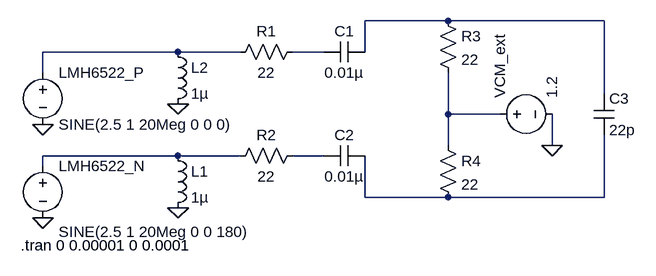
[diagram p0: schematic VCM switch.asc]
VCM switch.asc, the LTspice schematic file:
Version 4
SHEET 1 904 680
WIRE 608 -16 480 -16
WIRE 848 -16 608 -16
WIRE 192 32 -16 32
WIRE 288 32 192 32
WIRE 416 32 368 32
WIRE 480 32 480 -16
WIRE -16 64 -16 32
WIRE 848 96 848 -16
WIRE 608 128 608 64
WIRE 688 128 608 128
WIRE 608 176 608 128
WIRE 768 176 768 128
WIRE 192 192 -16 192
WIRE 288 192 192 192
WIRE 416 192 368 192
WIRE -16 208 -16 192
WIRE 480 256 480 192
WIRE 608 256 480 256
WIRE 848 256 848 160
WIRE 848 256 608 256
FLAG -16 144 0
FLAG -16 288 0
FLAG 192 272 0
FLAG 192 112 0
FLAG 768 176 0
SYMBOL voltage -16 48 R0
WINDOW 123 0 0 Left 2
WINDOW 39 0 0 Left 2
SYMATTR InstName LMH6522_P
SYMATTR Value SINE(2.5 1 20Meg 0 0 0)
SYMBOL voltage -16 192 R0
WINDOW 3 24 117 Left 2
WINDOW 123 0 0 Left 2
WINDOW 39 0 0 Left 2
SYMATTR InstName LMH6522_N
SYMATTR Value SINE(2.5 1 20Meg 0 0 180)
SYMBOL ind 176 176 R0
SYMATTR InstName L1
SYMATTR Value 1µ
SYMBOL ind 176 16 R0
SYMATTR InstName L2
SYMATTR Value 1µ
SYMBOL res 384 16 R90
WINDOW 0 0 56 VBottom 2
WINDOW 3 32 56 VTop 2
SYMATTR InstName R1
SYMATTR Value 22
SYMBOL res 384 176 R90
WINDOW 0 0 56 VBottom 2
WINDOW 3 32 56 VTop 2
SYMATTR InstName R2
SYMATTR Value 22
SYMBOL cap 480 16 R90
WINDOW 0 0 32 VBottom 2
WINDOW 3 32 32 VTop 2
SYMATTR InstName C1
SYMATTR Value 0.01µ
SYMBOL cap 480 176 R90
WINDOW 0 0 32 VBottom 2
WINDOW 3 32 32 VTop 2
SYMATTR InstName C2
SYMATTR Value 0.01µ
SYMBOL res 592 -32 R0
SYMATTR InstName R3
SYMATTR Value 22
SYMBOL res 592 160 R0
SYMATTR InstName R4
SYMATTR Value 22
SYMBOL voltage 672 128 R270
WINDOW 123 0 0 Left 2
WINDOW 39 0 0 Left 2
SYMATTR InstName VCM_ext
SYMATTR Value 1.2
SYMBOL cap 832 96 R0
SYMATTR InstName C3
SYMATTR Value 22p
TEXT -50 330 Left 2 !.tran 0 0.00001 0 0.0001

The netlist it stands for:
* VCM switch.asc
V§LMH6522_P N002 0 SINE(2.5 1 20Meg 0 0 0)
V§LMH6522_N N005 0 SINE(2.5 1 20Meg 0 0 180)
L1 N005 0 1µ
L2 N002 0 1µ
R1 N003 N002 22
R2 N006 N005 22
C1 N001 N003 0.01µ
C2 N007 N006 0.01µ
R3 N001 N004 22
R4 N004 N007 22
VCM_ext N004 0 1.2
C3 N001 N007 22p
.tran 0 0.00001 0 0.0001
.backanno
.end